# EAGLE schematic Blueberry Pi 7.1+axp203 (EAGLE 6.4)

## Sheet 1 of 5: IO / LRADC / RTL8237BS / Touch / SPI Flash
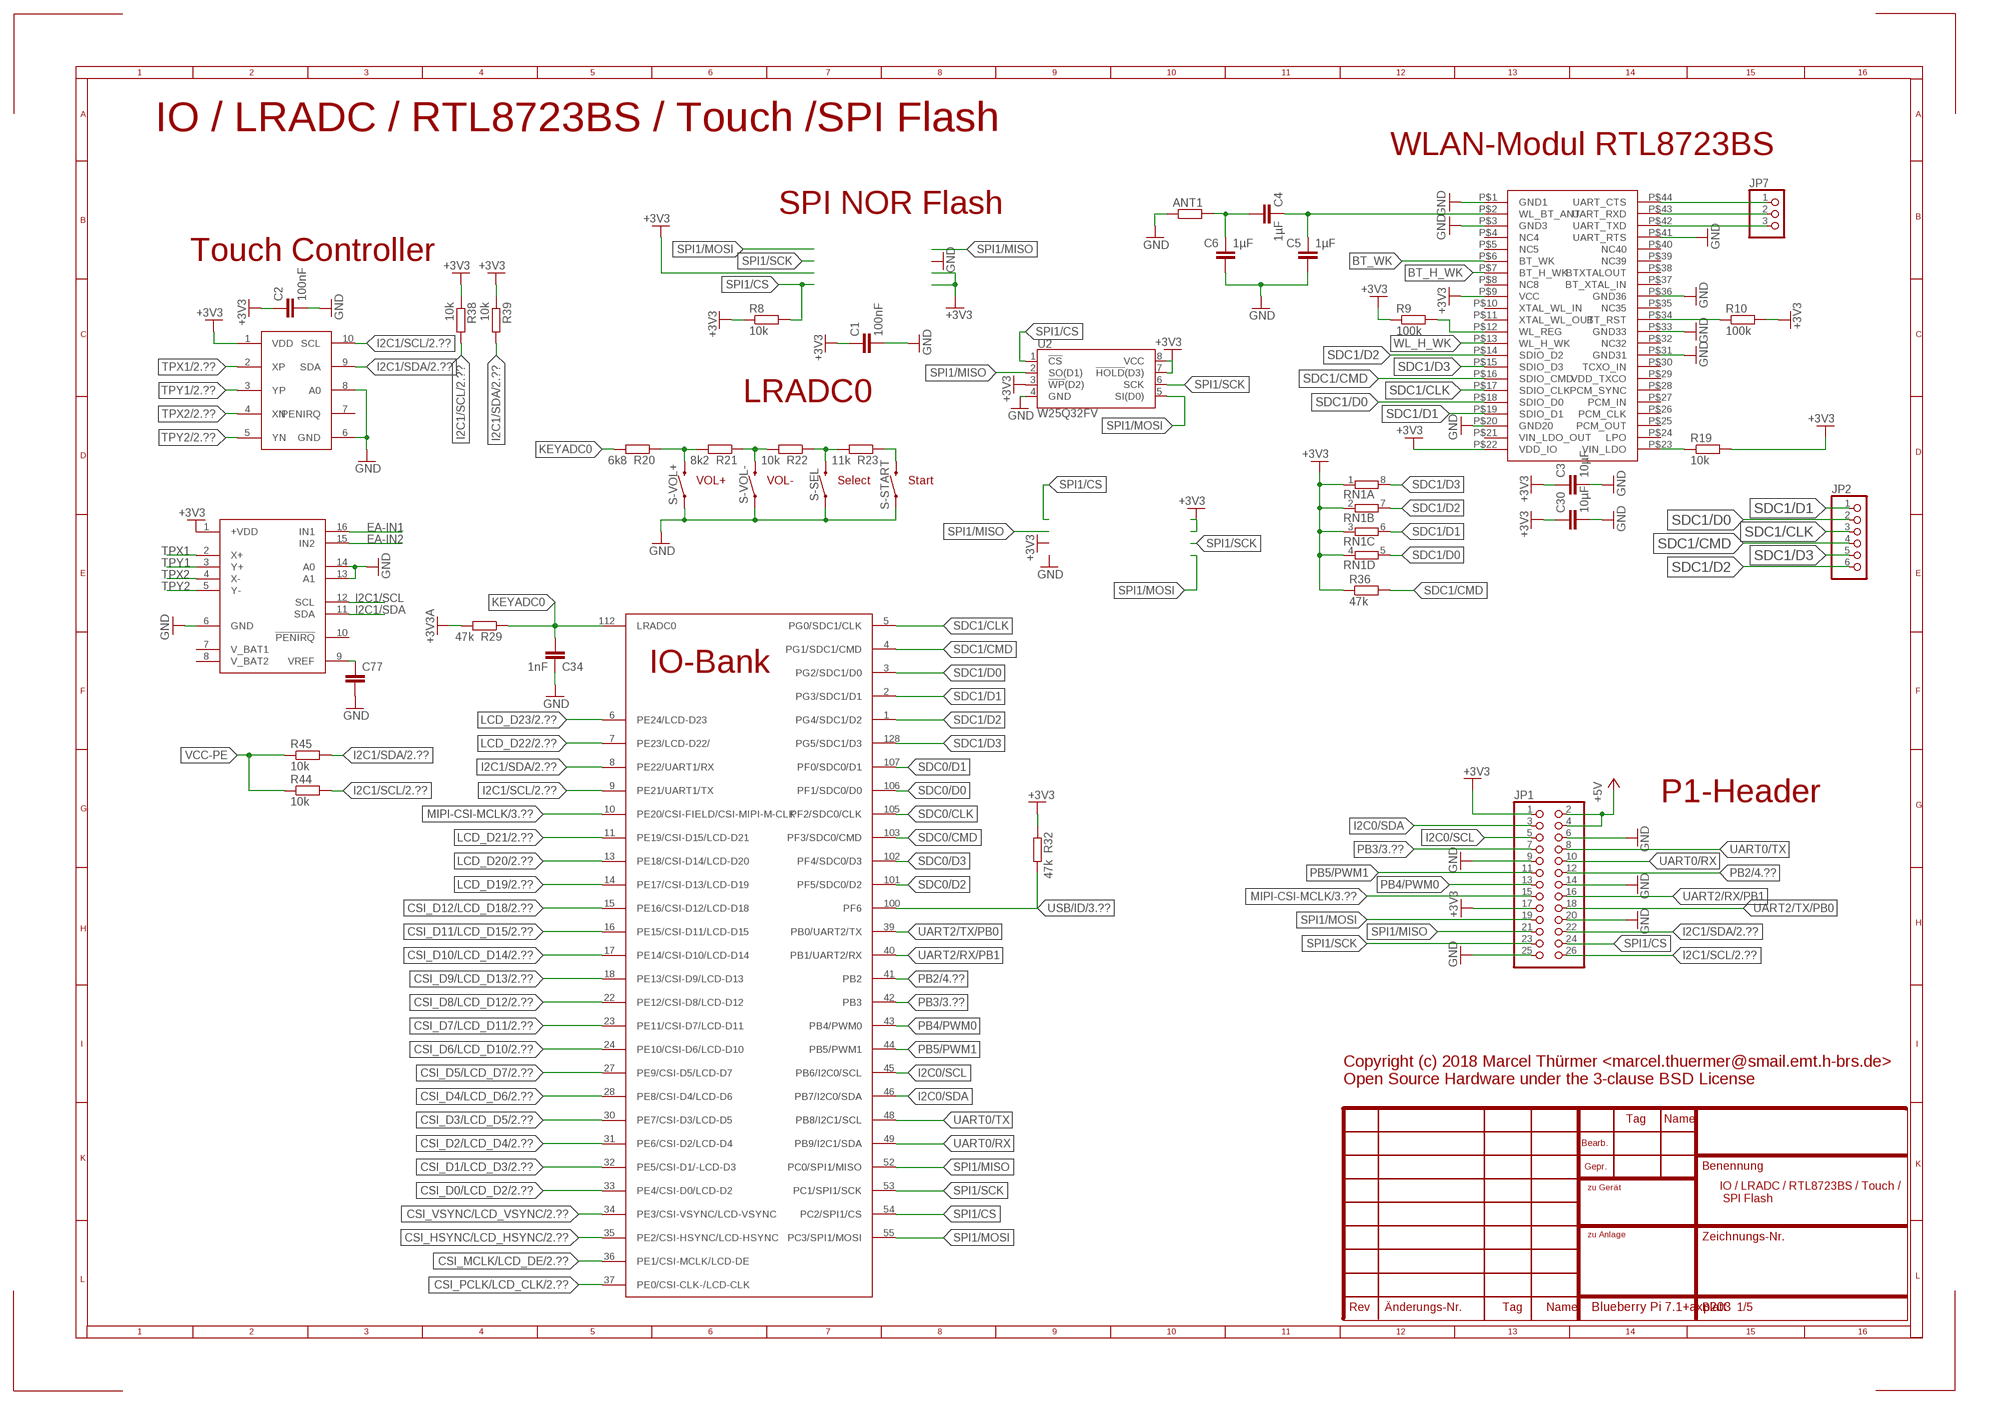
[diagram p0: schematic, sheet 1]

### Parts
ANT1  R-EU_R1206  [R1206]
C1  100nF  C-EUC0603  [C0603]
C2  100nF  C-EUC0603  [C0603]
C3  10µF  C-EUC0805  [C0805]
C4  1µF  C-EUC0603  [C0603]
C5  1µF  C-EUC0603  [C0603]
C6  1µF  C-EUC0603  [C0603]
C30  10µF  C-EUC0805  [C0805]
C34  1nF  C-EUC0603  [C0603]
C77  C-EUC0805  [C0805]
JP1  PINHD-2X13  [2X13]
JP2  PINHD-1X6_2.00  [1X06M]
JP7  PINHD-1X3M  [1X03M]
R8  10k  R-EU_R0603  [R0603]
R9  100k  R-EU_R0603  [R0603]
R10  100k  R-EU_R0603  [R0603]
R19  10k  R-EU_R0603  [R0603]
R20  6k8  R-EU_R0603  [R0603]
R21  8k2  R-EU_R0603  [R0603]
R22  10k  R-EU_R0603  [R0603]
R23  11k  R-EU_R0603  [R0603]
R29  47k  R-EU_R0603  [R0603]
R32  47k  R-EU_R0603  [R0603]
R36  47k  R-EU_R0603  [R0603]
R38  10k  R-EU_R0603  [R0603]
R39  10k  R-EU_R0603  [R0603]
R44  10k  R-EU_R0603  [R0603]
R45  10k  R-EU_R0603  [R0603]
RN1  4R-NEXB38V  [EXB38V]
S-SEL  SPARKFUN-SWITCHES_MOMENTARY-SWITCH-SPST-SMD-5.2-REDUNDANT  [SPARKFUN-SWITCHES_TACTILE_SWITCH_SMD_5.2MM]
S-START  SPARKFUN-SWITCHES_MOMENTARY-SWITCH-SPST-SMD-5.2-REDUNDANT  [SPARKFUN-SWITCHES_TACTILE_SWITCH_SMD_5.2MM]
S-VOL+  SPARKFUN-SWITCHES_MOMENTARY-SWITCH-SPST-SMD-5.2-REDUNDANT  [SPARKFUN-SWITCHES_TACTILE_SWITCH_SMD_5.2MM]
S-VOL-  SPARKFUN-SWITCHES_MOMENTARY-SWITCH-SPST-SMD-5.2-REDUNDANT  [SPARKFUN-SWITCHES_TACTILE_SWITCH_SMD_5.2MM]
U2  W25Q32FV  W25Q32FVSS  [SOIC-8]
U$1  V3S  [QFP-128]
U$2  RTL8723BS  [LGA]
U$7  TSC2003  [TSSOP16]
U$8  NS2009  [MSOP10]

### Nets
+3V3: C1.1 C2.1 C3.1 C30.1 JP1.1 JP1.17 R8.1 R9.1 R10.2 R19.2 R32.1 R36.1 R38.1 R39.1 RN1.1 RN1.2 RN1.3 RN1.4 U2.3(!WP!(D2)) U2.7(!HOLD!(D3)) U2.8(VCC) U$2.P$9(VCC) U$2.P$22(VDD_IO) U$7.1(+VDD) U$8.1(VDD) ; also sheet 2,3,4,5
+3V3A: R29.2 ; also sheet 3,4
+5V: JP1.2 JP1.4 ; also sheet 2,3,4
BT_H_WK: U$2.P$7(BT_H_WK)
BT_WK: U$2.P$6(BT_WK)
CSI_D0/LCD_D2: U$1.33(PE4/CSI-D0/LCD-D2) ; also sheet 2,5
CSI_D1/LCD_D3: U$1.32(PE5/CSI-D1/-LCD-D3) ; also sheet 2,5
CSI_D2/LCD_D4: U$1.31(PE6/CSI-D2/LCD-D4) ; also sheet 2,5
CSI_D3/LCD_D5: U$1.30(PE7/CSI-D3/LCD-D5) ; also sheet 2,5
CSI_D4/LCD_D6: U$1.28(PE8/CSI-D4/LCD-D6) ; also sheet 2,5
CSI_D5/LCD_D7: U$1.27(PE9/CSI-D5/LCD-D7) ; also sheet 2,5
CSI_D6/LCD_D10: U$1.24(PE10/CSI-D6/LCD-D10) ; also sheet 2,5
CSI_D7/LCD_D11: U$1.23(PE11/CSI-D7/LCD-D11) ; also sheet 2,5
CSI_D8/LCD_D12: U$1.22(PE12/CSI-D8/LCD-D12) ; also sheet 2,5
CSI_D9/LCD_D13: U$1.18(PE13/CSI-D9/LCD-D13) ; also sheet 2,5
CSI_D10/LCD_D14: U$1.17(PE14/CSI-D10/LCD-D14) ; also sheet 2,5
CSI_D11/LCD_D15: U$1.16(PE15/CSI-D11/LCD-D15) ; also sheet 2,5
CSI_D12/LCD_D18: U$1.15(PE16/CSI-D12/LCD-D18) ; also sheet 2,5
CSI_HSYNC/LCD_HSYNC: U$1.35(PE2/CSI-HSYNC/LCD-HSYNC) ; also sheet 2,5
CSI_MCLK/LCD_DE: U$1.36(PE1/CSI-MCLK/LCD-DE) ; also sheet 2,5
CSI_PCLK/LCD_CLK: U$1.37(PE0/CSI-CLK-/LCD-CLK) ; also sheet 2,5
CSI_VSYNC/LCD_VSYNC: U$1.34(PE3/CSI-VSYNC/LCD-VSYNC) ; also sheet 2,5
EA-IN1: U$7.16(IN1) ; also sheet 2
EA-IN2: U$7.15(IN2) ; also sheet 2
GND: ANT1.1 C1.2 C2.2 C3.2 C5.2 C6.2 C30.2 C34.1 C77.2 JP1.6 JP1.9 JP1.14 JP1.20 JP1.25 S-SEL.1 S-SEL.2 S-START.1 S-START.2 S-VOL+.1 S-VOL+.2 S-VOL-.1 S-VOL-.2 U2.4(GND) U$2.P$1(GND1) U$2.P$3(GND3) U$2.P$20(GND20) U$2.P$31(GND31) U$2.P$33(GND33) U$2.P$36(GND36) U$2.P$41(UART_RTS) U$7.6(GND) U$7.13(A1) U$7.14(A0) U$8.6(GND) U$8.8(A0) ; also sheet 2,3,4,5
I2C0/SCL: JP1.5 U$1.45(PB6/I2C0/SCL)
I2C0/SDA: JP1.3 U$1.46(PB7/I2C0/SDA)
I2C1/SCL: JP1.26 R38.2 R44.2 U$1.9(PE21/UART1/TX) U$7.12(SCL) U$8.10(SCL) ; also sheet 2,3,4
I2C1/SDA: JP1.22 R39.2 R45.2 U$1.8(PE22/UART1/RX) U$7.11(SDA) U$8.9(SDA) ; also sheet 2,3,4
KEYADC0: C34.2 R20.2 R29.1 U$1.112(LRADC0)
LCD_D19: U$1.14(PE17/CSI-D13/LCD-D19) ; also sheet 2,5
LCD_D20: U$1.13(PE18/CSI-D14/LCD-D20) ; also sheet 2,5
LCD_D21: U$1.11(PE19/CSI-D15/LCD-D21) ; also sheet 2,5
LCD_D22: U$1.7(PE23/LCD-D22/) ; also sheet 2,5
LCD_D23: U$1.6(PE24/LCD-D23) ; also sheet 2,5
MIPI-CSI-MCLK: JP1.15 U$1.10(PE20/CSI-FIELD/CSI-MIPI-M-CLK) ; also sheet 3
N$4: R19.1 U$2.P$23(VIN_LDO)
N$7: R9.2 U$2.P$12(WL_REG)
N$8: R20.1 R21.2 S-VOL+.3 S-VOL+.4
N$11: C77.1 U$7.9(VREF)
N$12: R10.1 U$2.P$34(BT_RST)
N$13: C4.1 C5.1 U$2.P$2(WL_BT_ANT)
N$14: ANT1.2 C4.2 C6.1
N$41: R21.1 R22.2 S-VOL-.3 S-VOL-.4
N$42: R22.1 R23.2 S-SEL.3 S-SEL.4
N$43: R23.1 S-START.3 S-START.4
N$61: JP7.1 U$2.P$44(UART_CTS)
N$62: JP7.2 U$2.P$43(UART_RXD)
N$63: JP7.3 U$2.P$42(UART_TXD)
PB2: JP1.12 U$1.41(PB2) ; also sheet 4
PB3: JP1.7 U$1.42(PB3) ; also sheet 3
PB4/PWM0: JP1.13 U$1.43(PB4/PWM0)
PB5/PWM1: JP1.11 U$1.44(PB5/PWM1)
SDC0/CLK: U$1.105(PF2/SDC0/CLK) ; also sheet 3
SDC0/CMD: U$1.103(PF3/SDC0/CMD) ; also sheet 3
SDC0/D0: U$1.106(PF1/SDC0/D0) ; also sheet 3
SDC0/D1: U$1.107(PF0/SDC0/D1) ; also sheet 3
SDC0/D2: U$1.101(PF5/SDC0/D2) ; also sheet 3
SDC0/D3: U$1.102(PF4/SDC0/D3) ; also sheet 3
SDC1/CLK: JP2.3 U$1.5(PG0/SDC1/CLK) U$2.P$17(SDIO_CLK)
SDC1/CMD: JP2.4 R36.2 U$1.4(PG1/SDC1/CMD) U$2.P$16(SDIO_CMD)
SDC1/D0: JP2.2 RN1.5 U$1.3(PG2/SDC1/D0) U$2.P$18(SDIO_D0)
SDC1/D1: JP2.1 RN1.6 U$1.2(PG3/SDC1/D1) U$2.P$19(SDIO_D1)
SDC1/D2: JP2.6 RN1.7 U$1.1(PG4/SDC1/D2) U$2.P$14(SDIO_D2)
SDC1/D3: JP2.5 RN1.8 U$1.128(PG5/SDC1/D3) U$2.P$15(SDIO_D3)
SPI1/CS: JP1.24 R8.2 U2.1(!CS!) U$1.54(PC2/SPI1/CS)
SPI1/MISO: JP1.21 U2.2(SO(D1)) U$1.52(PC0/SPI1/MISO)
SPI1/MOSI: JP1.19 U2.5(SI(D0)) U$1.55(PC3/SPI1/MOSI)
SPI1/SCK: JP1.23 U2.6(SCK) U$1.53(PC1/SPI1/SCK)
TPX1: U$7.2(X+) U$8.2(XP) ; also sheet 2
TPX2: U$7.4(X-) U$8.4(XN) ; also sheet 2
TPY1: U$7.3(Y+) U$8.3(YP) ; also sheet 2
TPY2: U$7.5(Y-) U$8.5(YN) ; also sheet 2
UART0/RX: JP1.10 U$1.49(PB9/I2C1/SDA)
UART0/TX: JP1.8 U$1.48(PB8/I2C1/SCL)
UART2/RX/PB1: JP1.16 U$1.40(PB1/UART2/RX)
UART2/TX/PB0: JP1.18 U$1.39(PB0/UART2/TX)
USB/ID: R32.2 U$1.100(PF6) ; also sheet 3
VCC-PE: R44.1 R45.1 ; also sheet 4
WL_H_WK: U$2.P$13(WL_H_WK)
Unconnected: U$2.P$4(NC4) U$2.P$5(NC5) U$2.P$8(NC8) U$2.P$10(XTAL_WL_IN) U$2.P$11(XTAL_WL_OUT) U$2.P$21(VIN_LDO_OUT) U$2.P$24(LPO) U$2.P$25(PCM_OUT) U$2.P$26(PCM_CLK) U$2.P$27(PCM_IN) U$2.P$28(PCM_SYNC) U$2.P$29(VDD_TXCO) U$2.P$30(TCXO_IN) U$2.P$32(NC32) U$2.P$35(NC35) U$2.P$37(BT_XTAL_IN) U$2.P$38(BTXTALOUT) U$2.P$39(NC39) U$2.P$40(NC40) U$7.7(V_BAT1) U$7.8(V_BAT2) U$7.10(!PENIRQ) U$8.7(PENIRQ)

### Notes on the sheet
- IO / LRADC / RTL8723BS / Touch /SPI Flash
- WLAN-Modul RTL8723BS
- SPI NOR Flash
- Touch Controller
- LRADC0
- VOL+ | VOL- | Select | Start
- P1-Header
- Copyright (c) 2018 Marcel Thürmer <marcel.thuermer@smail.emt.h-brs.de>
  Open Source Hardware under the 3-clause BSD License
- IO / LRADC / RTL8723BS / Touch /
   SPI Flash

## Sheet 2 of 5: LCD FFC / Camera FFC / Camera Header (OV7670, OV2640)
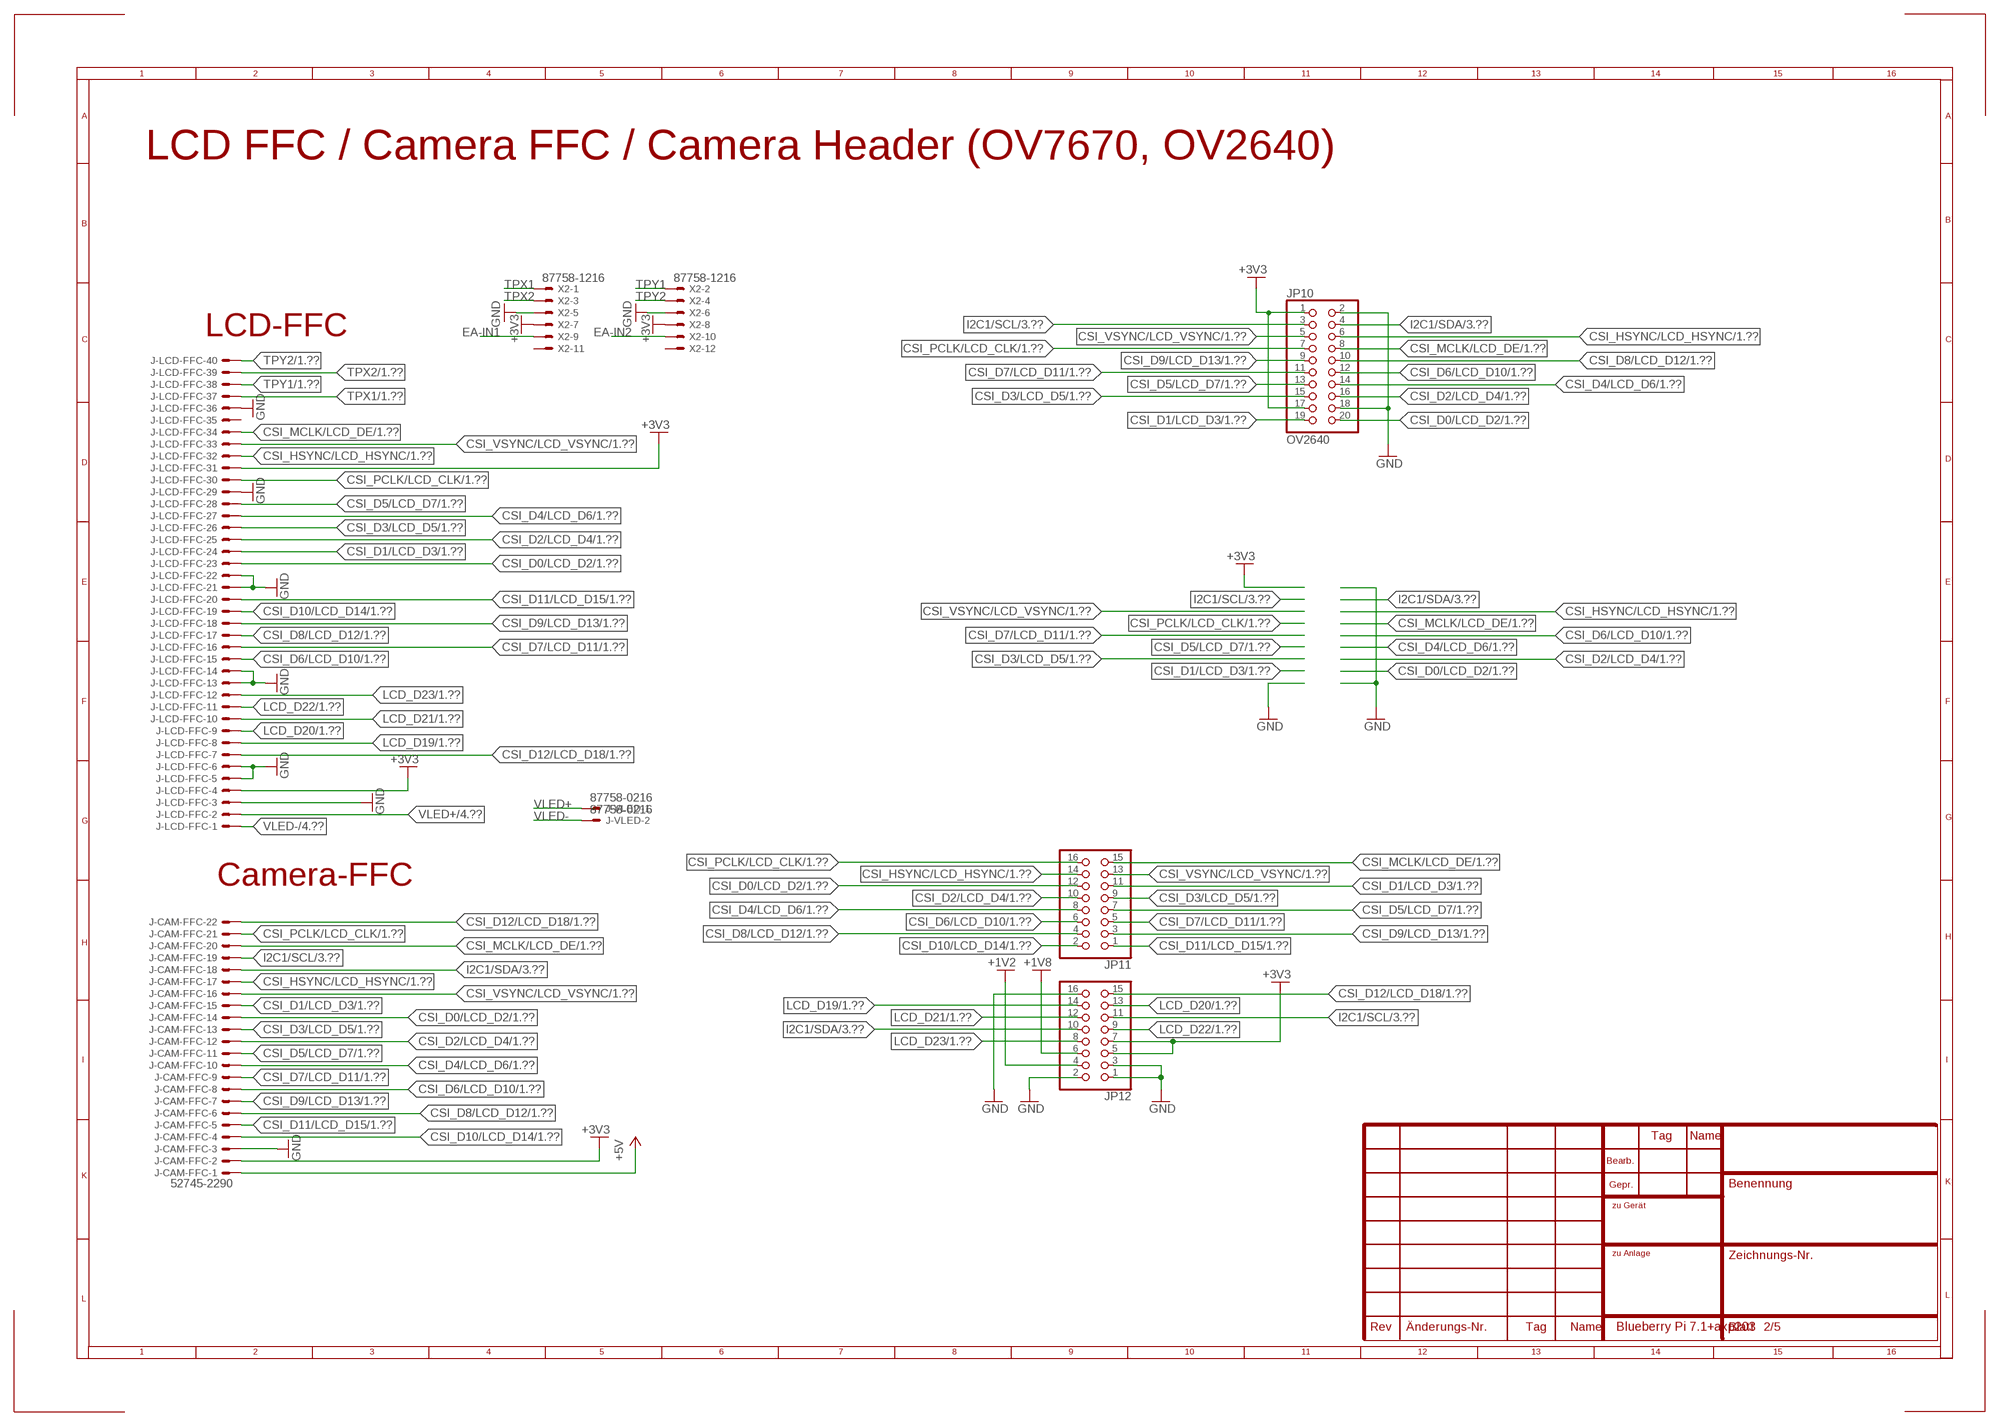
[diagram p1: schematic, sheet 2]

### Parts
J-CAM-FFC  52745-2290  [52745-2290]
J-LCD-FFC  40PINFPCH15-1LW  [XF2H-4015-1LW]
J-VLED  87758-0216  [87758-0216]
JP10  OV2640  PINHD-2X10  [2X10]
JP11  PINHD-2X8M  [2X08M]
JP12  PINHD-2X8M  [2X08M]
X2  87758-1216  [87758-1216]

### Nets
+1V2: JP12.4 ; also sheet 4
+1V8: JP12.6 ; also sheet 4
+3V3: J-CAM-FFC.2 J-LCD-FFC.4 J-LCD-FFC.31 JP10.1 JP10.17 JP12.5 JP12.7 X2.7 X2.8 ; also sheet 1,3,4,5
+5V: J-CAM-FFC.1 ; also sheet 1,3,4
CSI_D0/LCD_D2: J-CAM-FFC.14 J-LCD-FFC.23 JP10.20 JP11.12 ; also sheet 1,5
CSI_D1/LCD_D3: J-CAM-FFC.15 J-LCD-FFC.24 JP10.19 JP11.11 ; also sheet 1,5
CSI_D2/LCD_D4: J-CAM-FFC.12 J-LCD-FFC.25 JP10.16 JP11.10 ; also sheet 1,5
CSI_D3/LCD_D5: J-CAM-FFC.13 J-LCD-FFC.26 JP10.15 JP11.9 ; also sheet 1,5
CSI_D4/LCD_D6: J-CAM-FFC.10 J-LCD-FFC.27 JP10.14 JP11.8 ; also sheet 1,5
CSI_D5/LCD_D7: J-CAM-FFC.11 J-LCD-FFC.28 JP10.13 JP11.7 ; also sheet 1,5
CSI_D6/LCD_D10: J-CAM-FFC.8 J-LCD-FFC.15 JP10.12 JP11.6 ; also sheet 1,5
CSI_D7/LCD_D11: J-CAM-FFC.9 J-LCD-FFC.16 JP10.11 JP11.5 ; also sheet 1,5
CSI_D8/LCD_D12: J-CAM-FFC.6 J-LCD-FFC.17 JP10.10 JP11.4 ; also sheet 1,5
CSI_D9/LCD_D13: J-CAM-FFC.7 J-LCD-FFC.18 JP10.9 JP11.3 ; also sheet 1,5
CSI_D10/LCD_D14: J-CAM-FFC.4 J-LCD-FFC.19 JP11.2 ; also sheet 1,5
CSI_D11/LCD_D15: J-CAM-FFC.5 J-LCD-FFC.20 JP11.1 ; also sheet 1,5
CSI_D12/LCD_D18: J-CAM-FFC.22 J-LCD-FFC.7 JP12.15 ; also sheet 1,5
CSI_HSYNC/LCD_HSYNC: J-CAM-FFC.17 J-LCD-FFC.32 JP10.6 JP11.14 ; also sheet 1,5
CSI_MCLK/LCD_DE: J-CAM-FFC.20 J-LCD-FFC.34 JP10.8 JP11.15 ; also sheet 1,5
CSI_PCLK/LCD_CLK: J-CAM-FFC.21 J-LCD-FFC.30 JP10.7 JP11.16 ; also sheet 1,5
CSI_VSYNC/LCD_VSYNC: J-CAM-FFC.16 J-LCD-FFC.33 JP10.5 JP11.13 ; also sheet 1,5
EA-IN1: X2.9 ; also sheet 1
EA-IN2: X2.10 ; also sheet 1
GND: J-CAM-FFC.3 J-LCD-FFC.3 J-LCD-FFC.5 J-LCD-FFC.6 J-LCD-FFC.13 J-LCD-FFC.14 J-LCD-FFC.21 J-LCD-FFC.22 J-LCD-FFC.29 J-LCD-FFC.36 JP10.2 JP10.18 JP12.1 JP12.2 JP12.3 JP12.16 X2.5 X2.6 ; also sheet 1,3,4,5
I2C1/SCL: J-CAM-FFC.19 JP10.3 JP12.11 ; also sheet 1,3,4
I2C1/SDA: J-CAM-FFC.18 JP10.4 JP12.10 ; also sheet 1,3,4
LCD_D19: J-LCD-FFC.8 JP12.14 ; also sheet 1,5
LCD_D20: J-LCD-FFC.9 JP12.13 ; also sheet 1,5
LCD_D21: J-LCD-FFC.10 JP12.12 ; also sheet 1,5
LCD_D22: J-LCD-FFC.11 JP12.9 ; also sheet 1,5
LCD_D23: J-LCD-FFC.12 JP12.8 ; also sheet 1,5
TPX1: J-LCD-FFC.37 X2.1 ; also sheet 1
TPX2: J-LCD-FFC.39 X2.3 ; also sheet 1
TPY1: J-LCD-FFC.38 X2.2 ; also sheet 1
TPY2: J-LCD-FFC.40 X2.4 ; also sheet 1
VLED+: J-LCD-FFC.2 J-VLED.1 ; also sheet 4
VLED-: J-LCD-FFC.1 J-VLED.2 ; also sheet 4
Unconnected: J-LCD-FFC.35 X2.11 X2.12

### Notes on the sheet
- LCD FFC / Camera FFC / Camera Header (OV7670, OV2640)
- LCD-FFC
- Camera-FFC

## Sheet 3 of 5: Ethernet / USB Host / SDC0 / Audio / MIPI CSI
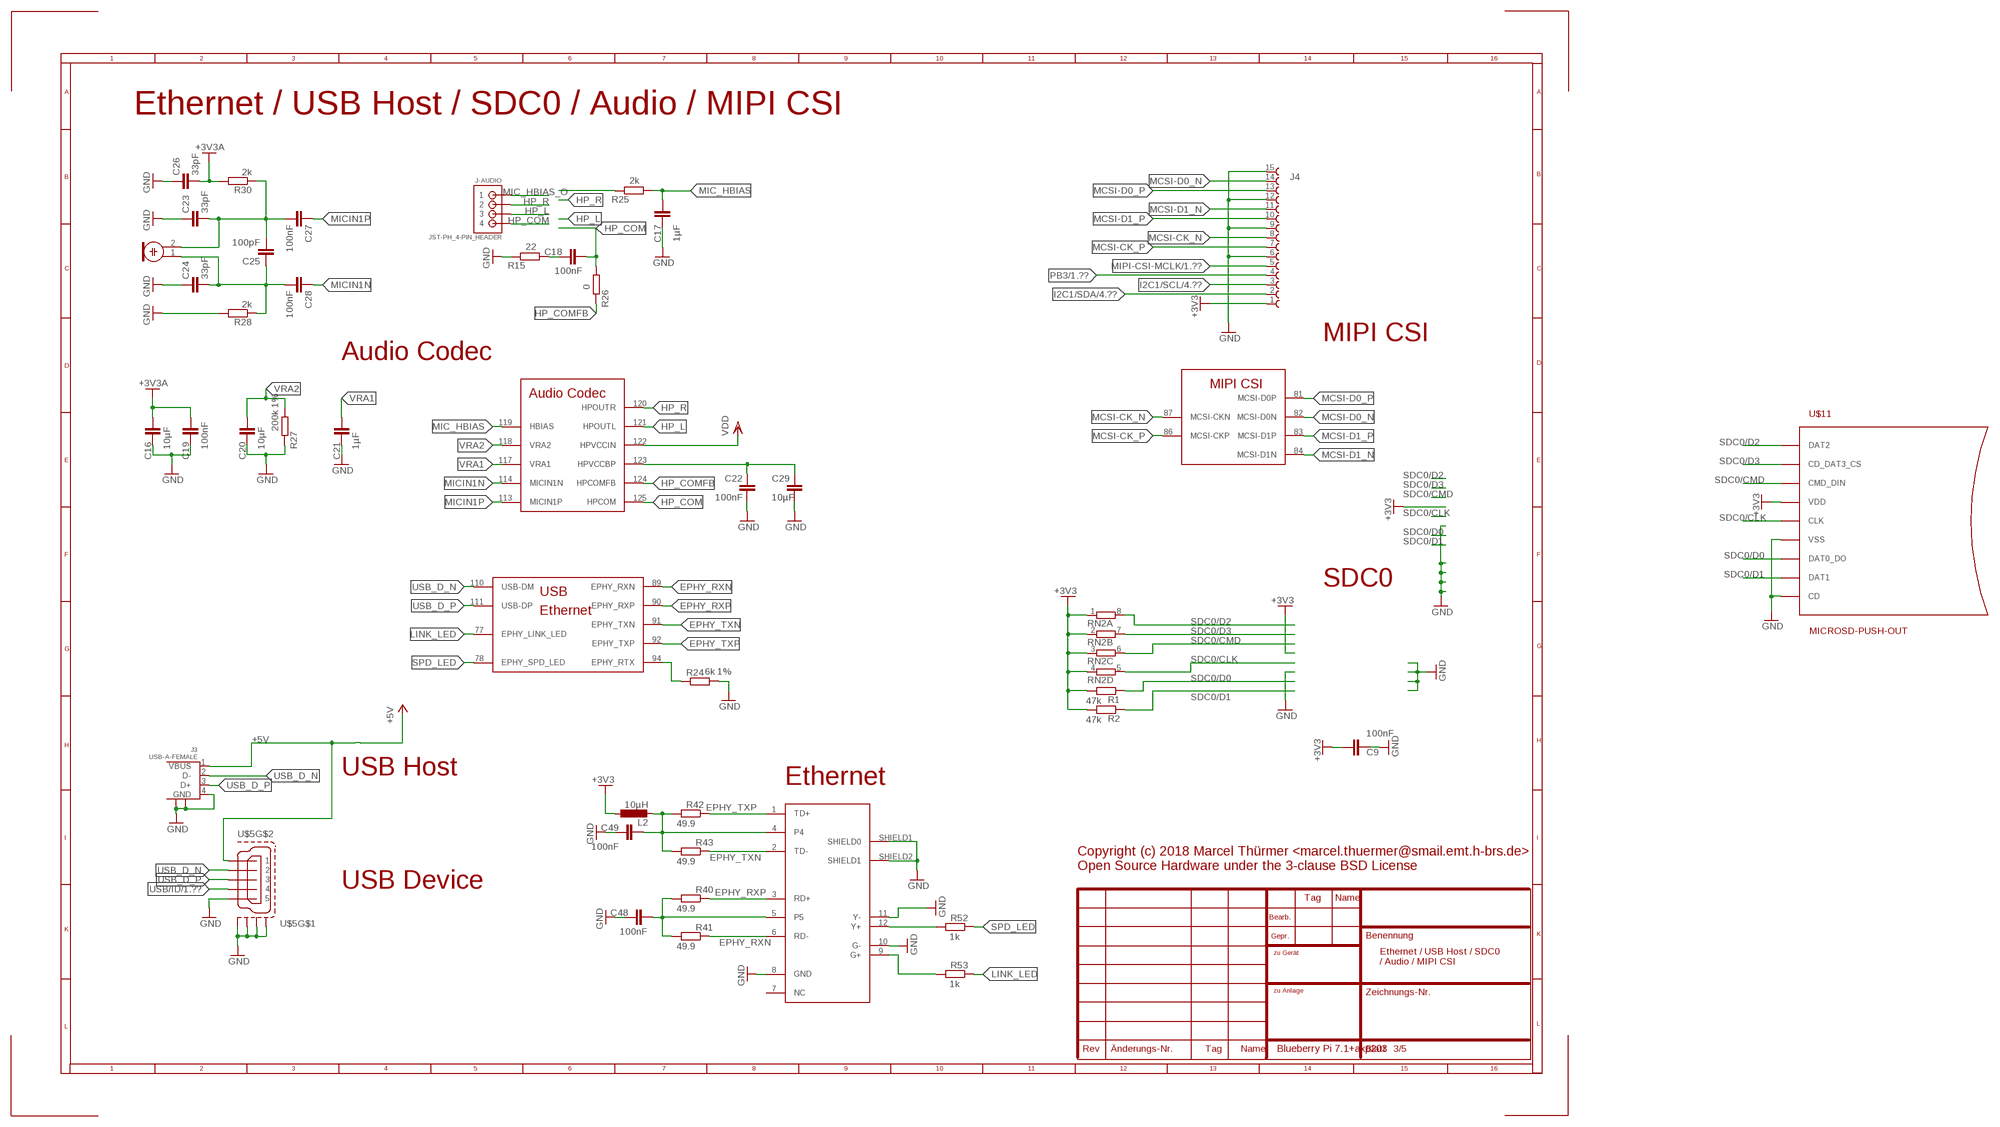
[diagram p2: schematic, sheet 3]

### Parts
C9  100nF  C-EUC0603  [C0603]
C16  10µF  C-EUC0805  [C0805]
C17  1µF  C-EUC0603  [C0603]
C18  100nF  C-EUC0603  [C0603]
C19  100nF  C-EUC0603  [C0603]
C20  10µF  C-EUC0805  [C0805]
C21  1µF  C-EUC0603  [C0603]
C22  100nF  C-EUC0603  [C0603]
C23  33pF  C-EUC0603  [C0603]
C24  33pF  C-EUC0603  [C0603]
C25  100pF  C-EUC0603  [C0603]
C26  33pF  C-EUC0603  [C0603]
C27  100nF  C-EUC0603  [C0603]
C28  100nF  C-EUC0603  [C0603]
C29  10µF  C-EUC0805  [C0805]
C48  100nF  C-EUC0603  [C0603]
C49  100nF  C-EUC0603  [C0603]
J3  USB-A-FEMALE  [USB-A-FEMALE]
J4  68611514122  [68611514122]
J-AUDIO  JST-PH_4-PIN_HEADER  [JST_B4B-PH_HEADER]
L2  10µH  L-EUR0805  [R0805]
MIC  ELECTRET_MICROPHON-F6035AP  [F6035AP]
R1  47k  R-EU_R0603  [R0603]
R2  47k  R-EU_R0603  [R0603]
R15  22  R-EU_R0603  [R0603]
R24  6k 1%  R-EU_R0603  [R0603]
R25  2k  R-EU_R0603  [R0603]
R26  0  R-EU_R0603  [R0603]
R27  200k 1%  R-EU_R0603  [R0603]
R28  2k  R-EU_R0603  [R0603]
R30  2k  R-EU_R0603  [R0603]
R40  49.9  R-EU_R0603  [R0603]
R41  49.9  R-EU_R0603  [R0603]
R42  49.9  R-EU_R0603  [R0603]
R43  49.9  R-EU_R0603  [R0603]
R52  1k  R-EU_R0603  [R0603]
R53  1k  R-EU_R0603  [R0603]
RN2  4R-NEXB38V  [EXB38V]
U$3  HR911105A  [RJ45]
U$5  MICRO-USB-SHIELD-ZX62R-B-5P  [ZX62R-B-5P]
U$11  MICROSD-PUSH-OUT  [MICROSD-PUSH-OUT]

### Nets
+3V3: C9.1 J4.1 L2.1 R1.2 R2.2 RN2.1 RN2.2 RN2.3 RN2.4 U$11.4(VDD) ; also sheet 1,2,4,5
+3V3A: C16.2 C19.2 C26.2 R30.2 ; also sheet 1,4
+5V: J3.1(VBUS) U$5.1 ; also sheet 1,2,4
EPHY_RXN: R41.1 U$1.89(EPHY_RXN) U$3.6(RD-)
EPHY_RXP: R40.1 U$1.90(EPHY_RXP) U$3.3(RD+)
EPHY_TXN: R43.1 U$1.91(EPHY_TXN) U$3.2(TD-)
EPHY_TXP: R42.1 U$1.92(EPHY_TXP) U$3.1(TD+)
GND: C9.2 C16.1 C17.2 C19.1 C20.1 C21.1 C22.2 C23.1 C24.1 C26.1 C29.1 C48.2 C49.2 J3.4(GND) J3.P$1 J3.P$2 J4.6 J4.9 J4.12 J4.15 R15.1 R24.2 R27.1 R28.2 U$3.8(GND) U$3.10(G-) U$3.11(Y-) U$3.SHIELD1(SHIELD0) U$3.SHIELD2(SHIELD1) U$5.5 U$5.M1(S1) U$5.M2(S2) U$5.M3(S3) U$5.M4(S4) U$11.6(VSS) U$11.CD U$11.G1(VSS) U$11.G2(VSS) U$11.G3(VSS) U$11.G4(VSS) ; also sheet 1,2,4,5
HP_COM: C18.2 J-AUDIO.P4 R26.2 U$1.125(HPCOM)
HP_COMFB: R26.1 U$1.124(HPCOMFB)
HP_L: J-AUDIO.P3 U$1.121(HPOUTL)
HP_R: J-AUDIO.P2 U$1.120(HPOUTR)
I2C1/SCL: J4.3 ; also sheet 1,2,4
I2C1/SDA: J4.2 ; also sheet 1,2,4
LINK_LED: R53.1 U$1.77(EPHY_LINK_LED)
MCSI-CK_N: J4.8 U$1.87(MCSI-CKN)
MCSI-CK_P: J4.7 U$1.86(MCSI-CKP)
MCSI-D0_N: J4.14 U$1.82(MCSI-D0N)
MCSI-D0_P: J4.13 U$1.81(MCSI-D0P)
MCSI-D1_N: J4.11 U$1.84(MCSI-D1N)
MCSI-D1_P: J4.10 U$1.83(MCSI-D1P)
MIC_HBIAS: C17.1 R25.2 U$1.119(HBIAS)
MIC_HBIAS_O: J-AUDIO.P1 R25.1
MICIN1N: C28.1 U$1.114(MICIN1N)
MICIN1P: C27.1 U$1.113(MICIN1P)
MIPI-CSI-MCLK: J4.5 ; also sheet 1
N$1: R24.1 U$1.94(EPHY_RTX)
N$18: R53.2 U$3.9(G+)
N$20: R52.2 U$3.12(Y+)
N$21: C49.1 L2.2 R42.2 R43.2 U$3.4
N$22: C48.1 R40.2 R41.2 U$3.5
N$28: C22.1 C29.2 U$1.123(HPVCCBP)
N$47: C18.1 R15.2
N$48: C23.2 C25.2 C27.2 MIC.2 R30.1
N$49: C24.2 C25.1 C28.2 MIC.1 R28.1
PB3: J4.4 ; also sheet 1
SDC0/CLK: RN2.5 U$11.5(CLK) ; also sheet 1
SDC0/CMD: RN2.6 U$11.3(CMD_DIN) ; also sheet 1
SDC0/D0: R1.1 U$11.7(DAT0_DO) ; also sheet 1
SDC0/D1: R2.1 U$11.8(DAT1) ; also sheet 1
SDC0/D2: RN2.8 U$11.1(DAT2) ; also sheet 1
SDC0/D3: RN2.7 U$11.2(CD_DAT3_CS) ; also sheet 1
SPD_LED: R52.1 U$1.78(EPHY_SPD_LED)
USB/ID: U$5.4 ; also sheet 1
USB_D_N: J3.2(D-) U$1.110(USB-DM) U$5.2
USB_D_P: J3.3(D+) U$1.111(USB-DP) U$5.3
VDD: U$1.122(HPVCCIN) ; also sheet 4
VRA1: C21.2 U$1.117(VRA1)
VRA2: C20.2 R27.2 U$1.118(VRA2)
Unconnected: U$3.7(NC)

### Notes on the sheet
- Ethernet / USB Host / SDC0 / Audio / MIPI CSI
- MIPI CSI
- Audio Codec
- SDC0
- USB Host
- Ethernet
- Copyright (c) 2018 Marcel Thürmer <marcel.thuermer@smail.emt.h-brs.de>
  Open Source Hardware under the 3-clause BSD License
- USB Device
- Ethernet / USB Host / SDC0 
  / Audio / MIPI CSI

## Sheet 4 of 5: VCC / RTC / PLL
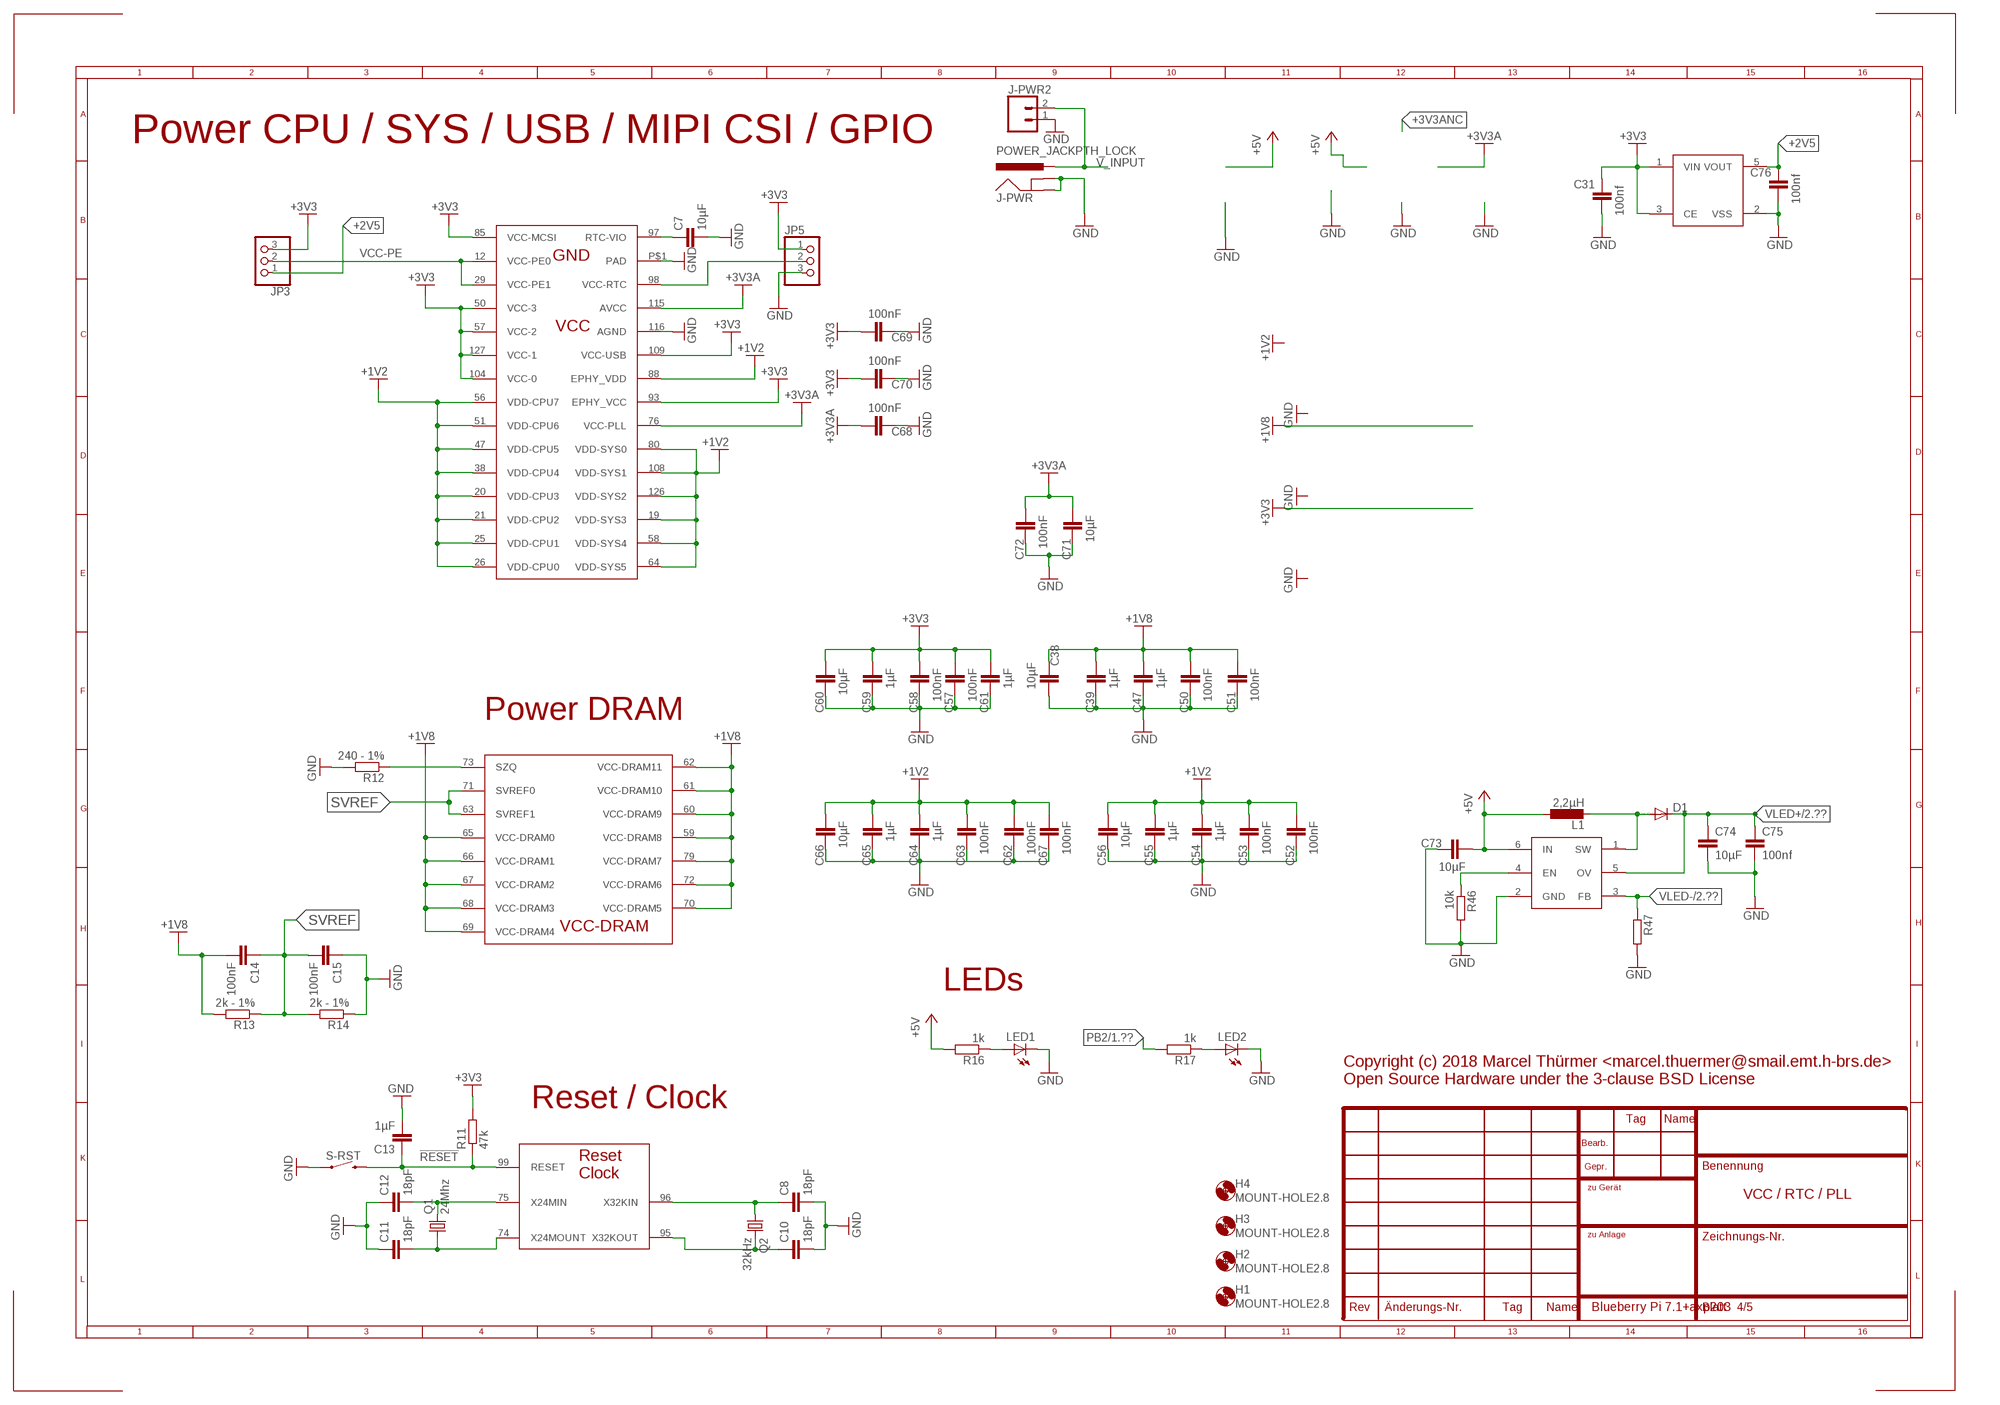
[diagram p3: schematic, sheet 4, part 1 of 2]
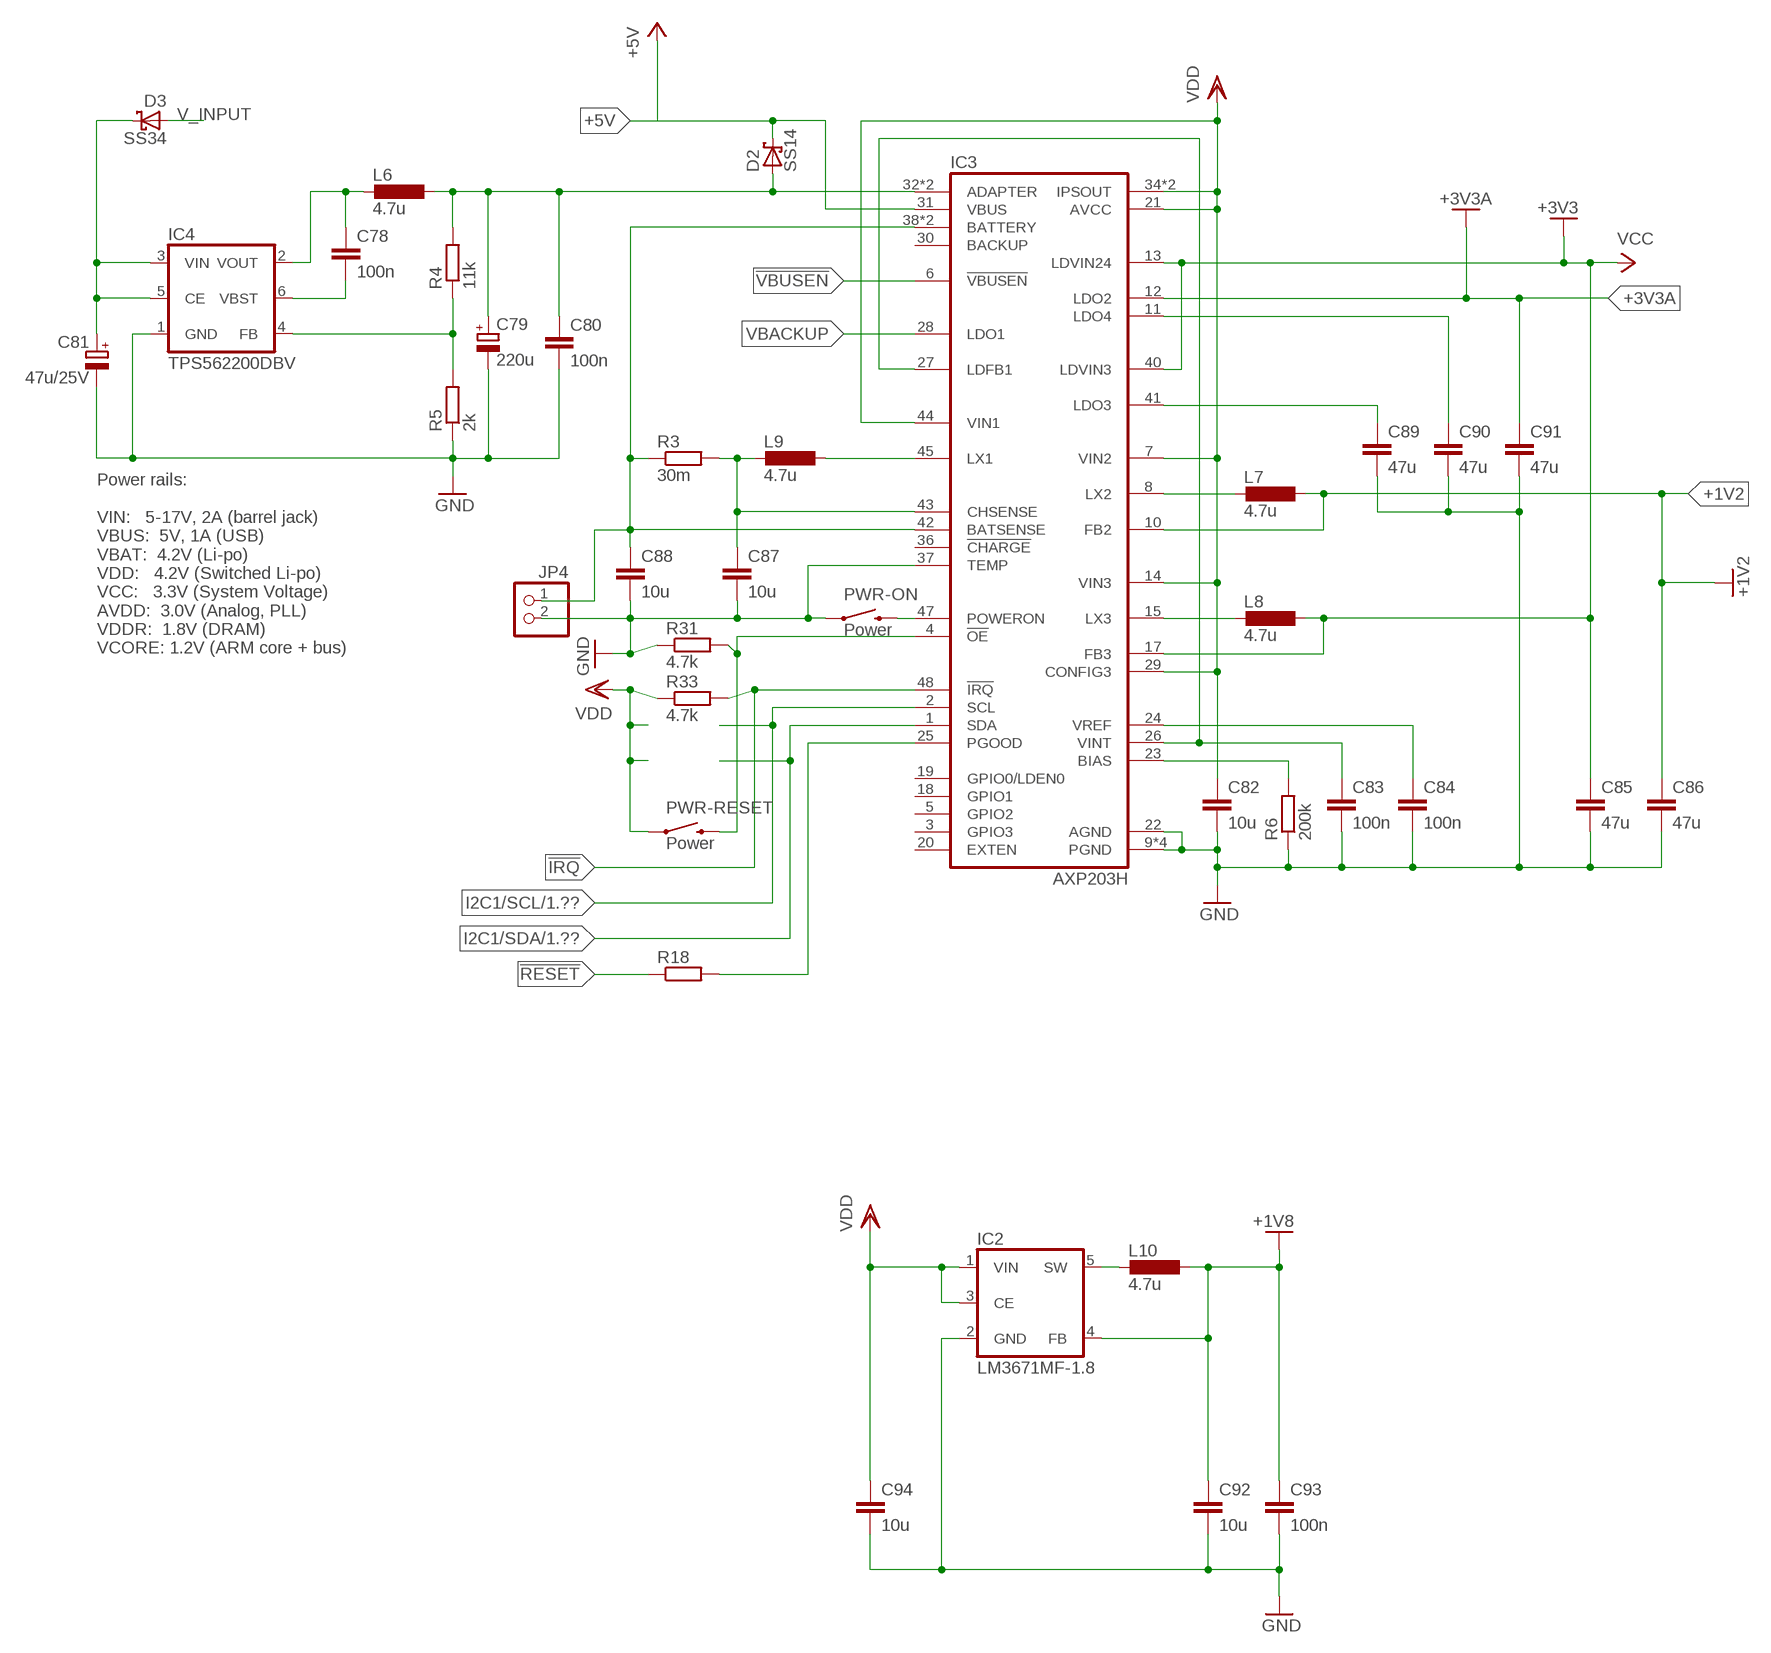
[diagram p4: schematic, sheet 4, part 2 of 2]

### Parts
C7  10µF  C-EUC0805  [C0805]
C8  18pF  C-EUC0603  [C0603]
C10  18pF  C-EUC0603  [C0603]
C11  18pF  C-EUC0603  [C0603]
C12  18pF  C-EUC0603  [C0603]
C13  1µF  C-EUC0603  [C0603]
C14  100nF  C-EUC0603  [C0603]
C15  100nF  C-EUC0603  [C0603]
C31  100nf  C-EUC0603  [C0603]
C38  10µF  C-EUC0603  [C0603]
C39  1µF  C-EUC0603  [C0603]
C47  1µF  C-EUC0603  [C0603]
C50  100nF  C-EUC0805  [C0805]
C51  100nF  C-EUC0603  [C0603]
C52  100nF  C-EUC0805  [C0805]
C53  100nF  C-EUC0603  [C0603]
C54  1µF  C-EUC0805  [C0805]
C55  1µF  C-EUC0603  [C0603]
C56  10µF  C-EUC0603  [C0603]
C57  100nF  C-EUC0603  [C0603]
C58  100nF  C-EUC0603  [C0603]
C59  1µF  C-EUC0805  [C0805]
C60  10µF  C-EUC0603  [C0603]
C61  1µF  C-EUC0805  [C0805]
C62  100nF  C-EUC0603  [C0603]
C63  100nF  C-EUC0805  [C0805]
C64  1µF  C-EUC0603  [C0603]
C65  1µF  C-EUC0603  [C0603]
C66  10µF  C-EUC0805  [C0805]
C67  100nF  C-EUC0603  [C0603]
C68  100nF  C-EUC0603  [C0603]
C69  100nF  C-EUC0805  [C0805]
C70  100nF  C-EUC0603  [C0603]
C71  10µF  C-EUC0603  [C0603]
C72  100nF  C-EUC0603  [C0603]
C73  10µF  C-EUC0805  [C0805]
C74  10µF  C-EUC0805  [C0805]
C75  100nf  C-EUC0603  [C0603]
C76  100nf  C-EUC0603  [C0603]
C78  100n  C-EUC0603  [C0603]
C79  220u  CPOL-EU153CLV-0405  [153CLV-0405]
C80  100n  C-EUC0603  [C0603]
C81  47u/25V  CPOL-EU153CLV-0405  [153CLV-0405]
C82  10u  C-EUC0805  [C0805]
C83  100n  C-EUC0603  [C0603]
C84  100n  C-EUC0603  [C0603]
C85  47u  C-EUC1206  [C1206]
C86  47u  C-EUC1206  [C1206]
C87  10u  C-EUC0805  [C0805]
C88  10u  C-EUC0805  [C0805]
C89  47u  C-EUC1206  [C1206]
C90  47u  C-EUC1206  [C1206]
C91  47u  C-EUC1206  [C1206]
C92  10u  C-EUC0805  [C0805]
C93  100n  C-EUC0603  [C0603]
C94  10u  C-EUC0805  [C0805]
D1  DIODE-SOD323-W  [SOD323-W]
D2  SS14  SCHOTTKY-DIODEDO214AC  [DO214AC]
D3  SS34  SCHOTTKY-DIODEDO214AC  [DO214AC]
H1  MOUNT-HOLE2.8  [2,8]
H2  MOUNT-HOLE2.8  [2,8]
H3  MOUNT-HOLE2.8  [2,8]
H4  MOUNT-HOLE2.8  [2,8]
IC2  LM3671MF-1.8  [SOT23-5L]
IC3  AXP203H  [QFN48-6X6-H]
IC4  TPS562200DBV  [SOT23-6L]
J-PWR  POWER_JACKPTH_LOCK  [POWER_JACK_PTH_LOCK]
J-PWR2  CONN_02  [1X02]
JP3  PINHD-1X3  [1X03]
JP4  PINHD-1X2  [1X02]
JP5  PINHD-1X3  [1X03]
L1  2,2µH  L-EUR0805  [R0805]
L6  4.7u  L-EUL5650M  [L5650M]
L7  4.7u  L-EUL5650M  [L5650M]
L8  4.7u  L-EUL5650M  [L5650M]
L9  4.7u  L-EUL5650M  [L5650M]
L10  4.7u  L-EUL5650M  [L5650M]
LED1  LEDCHIPLED_0805  [CHIPLED_0805]
LED2  LEDCHIPLED_0805  [CHIPLED_0805]
PWR-ON  Power  SWITCH-MOMENTARY-2SMD  [TACTILE-SWITCH-SMD]
PWR-RESET  Power  SWITCH-MOMENTARY-2SMD  [TACTILE-SWITCH-SMD]
Q1  24Mhz  CRYSTALHC49U-V  [HC49U-V]
Q2  32kHz  CRYSTALTC38H  [TC38H]
R3  30m  R-EU_R2512  [R2512]
R4  11k  R-EU_R0603  [R0603]
R5  2k  R-EU_R0603  [R0603]
R6  200k  R-EU_R0603  [R0603]
R11  47k  R-EU_R0603  [R0603]
R12  240 - 1%  R-EU_R0603  [R0603]
R13  2k - 1%  R-EU_R0603  [R0603]
R14  2k - 1%  R-EU_R0603  [R0603]
R16  1k  R-EU_R0603  [R0603]
R17  1k  R-EU_R0603  [R0603]
R18  R-EU_R0603  [R0603]
R31  4.7k  R-EU_R0603  [R0603]
R33  4.7k  R-EU_R0603  [R0603]
R46  10k  R-EU_R0603  [R0603]
R47  R-EU_R0603  [R0603]
S-RST  SPARKFUN-SWITCHES_MOMENTARY-SWITCH-SPST-SMD-5.2-REDUNDANT  [SPARKFUN-SWITCHES_TACTILE_SWITCH_SMD_5.2MM]
U$6  XC6204  XC6204XC6204  [SOT25]
U$9  PT4101  [SOT23-6]

### Nets
!IRQ: IC3.48(!IRQ) R33.2
!RESET: C13.1 R11.1 R18.1 S-RST.3 S-RST.4 U$1.99(RESET)
!VBUSEN: IC3.6(!VBUSEN)
+1V2: C52.1 C53.1 C54.1 C55.1 C56.1 C62.1 C63.1 C64.1 C65.1 C66.1 C67.1 C86.1 IC3.10(FB2) L7.1 U$1.19(VDD-SYS3) U$1.20(VDD-CPU3) U$1.21(VDD-CPU2) U$1.25(VDD-CPU1) U$1.26(VDD-CPU0) U$1.38(VDD-CPU4) U$1.47(VDD-CPU5) U$1.51(VDD-CPU6) U$1.56(VDD-CPU7) U$1.58(VDD-SYS4) U$1.64(VDD-SYS5) U$1.80(VDD-SYS0) U$1.88(EPHY_VDD) U$1.108(VDD-SYS1) U$1.126(VDD-SYS2) ; also sheet 2
+1V8: C14.2 C38.2 C39.1 C47.1 C50.1 C51.1 C92.1 C93.1 IC2.4(FB) L10.1 R13.2 U$1.59(VCC-DRAM8) U$1.60(VCC-DRAM9) U$1.61(VCC-DRAM10) U$1.62(VCC-DRAM11) U$1.65(VCC-DRAM0) U$1.66(VCC-DRAM1) U$1.67(VCC-DRAM2) U$1.68(VCC-DRAM3) U$1.69(VCC-DRAM4) U$1.70(VCC-DRAM5) U$1.72(VCC-DRAM6) U$1.79(VCC-DRAM7) ; also sheet 2
+2V5: C76.1 JP3.1 U$6.5(VOUT)
+3V3: C31.1 C57.1 C58.1 C59.1 C60.1 C61.1 C69.1 C70.1 C85.1 IC3.13(LDVIN24) IC3.17(FB3) IC3.40(LDVIN3) JP3.3 JP5.1 L8.1 R11.2 U$1.50(VCC-3) U$1.57(VCC-2) U$1.85(VCC-MCSI) U$1.93(EPHY_VCC) U$1.104(VCC-0) U$1.109(VCC-USB) U$1.127(VCC-1) U$6.1(VIN) U$6.3(CE) ; supply symbol labelled VCC ; also sheet 1,2,3,5
+3V3A: C68.1 C71.1 C72.1 C91.1 IC3.12(LDO2) U$1.76(VCC-PLL) U$1.115(AVCC) ; also sheet 1,3
+5V: C73.1 D2.C IC3.31(VBUS) L1.1 R16.2 U$9.6(IN) ; also sheet 1,2,3
GND: C7.2 C8.2 C10.2 C11.1 C12.1 C13.2 C15.1 C31.2 C38.1 C39.2 C47.2 C50.2 C51.2 C52.2 C53.2 C54.2 C55.2 C56.2 C57.2 C58.2 C59.2 C60.2 C61.2 C62.2 C63.2 C64.2 C65.2 C66.2 C67.2 C68.2 C69.2 C70.2 C71.2 C72.2 C73.2 C74.2 C75.2 C76.2 C79.- C80.2 C81.- C82.2 C83.2 C84.2 C85.2 C86.2 C87.2 C88.2 C89.2 C90.2 C91.2 C92.2 C93.2 C94.2 IC2.2(GND) IC3.9(PGND) IC3.16(PGND) IC3.22(AGND) IC3.37(TEMP) IC3.46(PGND) IC3.P(PGND) IC4.1(GND) J-PWR2.1 J-PWR.GND J-PWR.GNDBREAK JP4.2 JP5.3 LED1.C LED2.C PWR-ON.1 R5.1 R6.1 R12.2 R14.1 R31.1 R46.2 R47.2 S-RST.1 S-RST.2 U$1.116(AGND) U$1.P$1(PAD) U$6.2(VSS) U$9.2(GND) ; also sheet 1,2,3,5
I2C1/SCL: IC3.2(SCL) ; also sheet 1,2,3
I2C1/SDA: IC3.1(SDA) ; also sheet 1,2,3
N$3: LED1.A R16.1
N$5: C79.+ C80.1 D2.A IC3.32(ADAPTER) IC3.33(ADAPTER) L6.1 R4.2
N$6: LED2.A R17.1
N$9: R46.1 U$9.4(EN)
N$10: D1.A L1.2 U$9.1(SW)
N$15: C78.1 IC4.2(VOUT) L6.2
N$16: C78.2 IC4.6(VBST)
N$17: IC4.4(FB) R4.1 R5.2
N$19: C81.+ D3.C IC4.3(VIN) IC4.5(CE)
N$23: C7.1 U$1.97(RTC-VIO)
N$24: IC3.23(BIAS) R6.2
N$25: C83.1 IC3.26(VINT) IC3.27(LDFB1)
N$26: JP5.2 U$1.98(VCC-RTC)
N$27: C84.1 IC3.24(VREF)
N$29: C10.1 Q2.2 U$1.95(X32KOUT)
N$30: C8.1 Q2.1 U$1.96(X32KIN)
N$31: IC3.8(LX2) L7.2
N$32: C11.2 Q1.1 U$1.74(X24MOUNT)
N$33: C12.2 Q1.2 U$1.75(X24MIN)
N$34: IC3.15(LX3) L8.2
N$36: R12.1 U$1.73(SZQ)
N$37: C87.1 IC3.43(CHSENSE) L9.2 R3.2
N$38: IC3.45(LX1) L9.1
N$39: C88.1 IC3.38(BATTERY) IC3.39(BATTERY) IC3.42(BATSENSE) JP4.1 R3.1
N$40: IC3.47(POWERON) PWR-ON.3
N$44: C89.1 IC3.41(LDO3)
N$45: C90.1 IC3.11(LDO4)
N$46: IC3.4(!OE) PWR-RESET.3 R31.2
N$50: IC3.25(PGOOD) R18.2
N$51: IC2.5(SW) L10.2
PB2: R17.2 ; also sheet 1
SVREF: C14.1 C15.2 R13.1 R14.2 U$1.63(SVREF1) U$1.71(SVREF0)
V_INPUT: D3.A J-PWR2.2 J-PWR.PWR
VBACKUP: IC3.28(LDO1)
VCC-PE: JP3.2 U$1.12(VCC-PE0) U$1.29(VCC-PE1) ; also sheet 1
VDD: C82.1 C94.1 IC2.1(VIN) IC2.3(CE) IC3.7(VIN2) IC3.14(VIN3) IC3.21(AVCC) IC3.29(CONFIG3) IC3.34(IPSOUT) IC3.35(IPSOUT) IC3.44(VIN1) PWR-RESET.1 R33.1 ; also sheet 3
VLED+: C74.1 C75.1 D1.C U$9.5(OV) ; also sheet 2
VLED-: R47.1 U$9.3(FB) ; also sheet 2
Unconnected: IC3.3(GPIO3) IC3.5(GPIO2) IC3.18(GPIO1) IC3.19(GPIO0/LDEN0) IC3.20(EXTEN) IC3.30(BACKUP) IC3.36(!CHARGE)

### Notes on the sheet
- Power CPU / SYS / USB / MIPI CSI / GPIO
- Power DRAM
- Power rails:
  
  VIN:   5-17V, 2A (barrel jack)
  VBUS:  5V, 1A (USB)
  VBAT:  4.2V (Li-po)
  VDD:   4.2V (Switched Li-po)
  VCC:   3.3V (System Voltage)
  AVDD:  3.0V (Analog, PLL)
  VDDR:  1.8V (DRAM)
  VCORE: 1.2V (ARM core + bus)
- LEDs
- Copyright (c) 2018 Marcel Thürmer <marcel.thuermer@smail.emt.h-brs.de>
  Open Source Hardware under the 3-clause BSD License
- Reset / Clock
- VCC / RTC / PLL

## Sheet 5 of 5: sn65lvds84
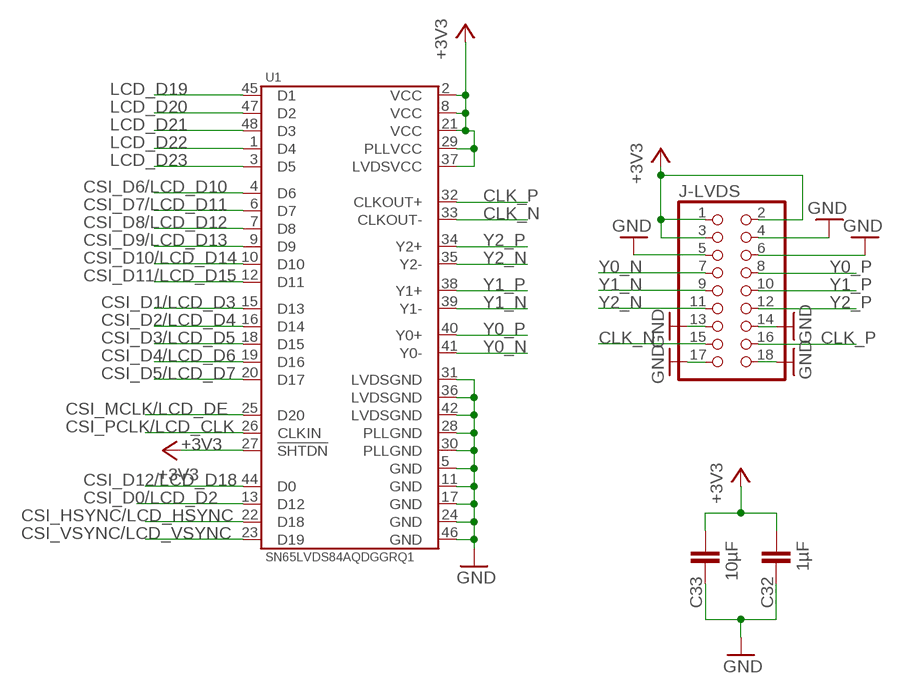
[diagram p5: schematic, sheet 5]

### Parts
C32  1µF  C-EUC0603  [C0603]
C33  10µF  C-EUC0805  [C0805]
J-LVDS  PINHEAD_PINHD-2X9M  [PINHEAD_2X09M]
U1  SN65LVDS84AQDGGRQ1  [TFSOP-48-6.1MM]

### Nets
+3V3: C32.1 C33.1 J-LVDS.1 J-LVDS.2 J-LVDS.3 U1.2(VCC) U1.8(VCC) U1.21(VCC) U1.27(!SHTDN) U1.29(PLLVCC) U1.37(LVDSVCC) ; also sheet 1,2,3,4
CLK_N: J-LVDS.15 U1.33(CLKOUT-)
CLK_P: J-LVDS.16 U1.32(CLKOUT+)
CSI_D0/LCD_D2: U1.13(D12) ; also sheet 1,2
CSI_D1/LCD_D3: U1.15(D13) ; also sheet 1,2
CSI_D2/LCD_D4: U1.16(D14) ; also sheet 1,2
CSI_D3/LCD_D5: U1.18(D15) ; also sheet 1,2
CSI_D4/LCD_D6: U1.19(D16) ; also sheet 1,2
CSI_D5/LCD_D7: U1.20(D17) ; also sheet 1,2
CSI_D6/LCD_D10: U1.4(D6) ; also sheet 1,2
CSI_D7/LCD_D11: U1.6(D7) ; also sheet 1,2
CSI_D8/LCD_D12: U1.7(D8) ; also sheet 1,2
CSI_D9/LCD_D13: U1.9(D9) ; also sheet 1,2
CSI_D10/LCD_D14: U1.10(D10) ; also sheet 1,2
CSI_D11/LCD_D15: U1.12(D11) ; also sheet 1,2
CSI_D12/LCD_D18: U1.44(D0) ; also sheet 1,2
CSI_HSYNC/LCD_HSYNC: U1.22(D18) ; also sheet 1,2
CSI_MCLK/LCD_DE: U1.25(D20) ; also sheet 1,2
CSI_PCLK/LCD_CLK: U1.26(CLKIN) ; also sheet 1,2
CSI_VSYNC/LCD_VSYNC: U1.23(D19) ; also sheet 1,2
GND: C32.2 C33.2 J-LVDS.4 J-LVDS.5 J-LVDS.6 J-LVDS.13 J-LVDS.14 J-LVDS.17 J-LVDS.18 U1.5(GND) U1.11(GND) U1.17(GND) U1.24(GND) U1.28(PLLGND) U1.30(PLLGND) U1.31(LVDSGND) U1.36(LVDSGND) U1.42(LVDSGND) U1.46(GND) ; also sheet 1,2,3,4
LCD_D19: U1.45(D1) ; also sheet 1,2
LCD_D20: U1.47(D2) ; also sheet 1,2
LCD_D21: U1.48(D3) ; also sheet 1,2
LCD_D22: U1.1(D4) ; also sheet 1,2
LCD_D23: U1.3(D5) ; also sheet 1,2
Y0_N: J-LVDS.7 U1.41(Y0-)
Y0_P: J-LVDS.8 U1.40(Y0+)
Y1_N: J-LVDS.9 U1.39(Y1-)
Y1_P: J-LVDS.10 U1.38(Y1+)
Y2_N: J-LVDS.11 U1.35(Y2-)
Y2_P: J-LVDS.12 U1.34(Y2+)

## Library data of the parts
ANT1 R1-R6 R8-R33 R36 R38-R47 R52 R53 = rcl:R-EU_: RESISTOR, European symbol
C1-C34 C38 C39 C47-C76 C78 C80 C82-C94 = rcl:C-EU: CAPACITOR, European symbol
C77 = resistor:C-EU: CAPACITOR, European symbol
C79 C81 = rcl:CPOL-EU: POLARIZED CAPACITOR, European symbol
D1 = diode:DIODE-: DIODE
D2 D3 = diode:SCHOTTKY-DIODE: Schottky Diode
H1 H2 H4 = holes:MOUNT-HOLE: MOUNTING HOLE with drill center marker
H3 = holes@1:MOUNT-HOLE: MOUNTING HOLE with drill center marker
IC2 = Allwinner V3s:LM3671?: Integrated Switch Synchronous Buck Converter
IC3 = Allwinner V3s:AXP203
IC4 = Allwinner V3s:TPS56*200
J3 = Connectors:USB
J4 = EAGLE-FPC_CONNECTOR_AND_FFC_CAB-rev16b:68611514122: WR-FPC 1.00mm SMT ZIF Horizontal Top Contact, 15 Pins=>Code : Con_FPC_ZIF_1.00_68611514122 <http://katalog.we-online.de/media/images/eican/Con_FPC_ZIF_1.00_6861xx14122_pf2.jpg> Details see: http://katalog.we-online.de/en/em/686_1xx_141_22 Created 2014-07-09, Karrer Zheng 2014 (C) Würth Elektronik
J-AUDIO = srg:JST-PH_4-PIN_HEADER: 4-pin JST PH Shrouded Header, top entry P/N B4B-PH-K-S Mating connector PHR-4 Mating cable assembly: Sparkfun PRT-09916 <http://www.sparkfun.com/products/9916>
J-CAM-FFC = con-molex:52745-2290: FFC/FPC-to-Board 0.50mm (.020") SMT Top Contact Right Angle, ZIF, Style Receptacle 52745 / 52435 Source: http://www.molex.com/product/ffc/52745.html; OC_FARNELL: unknown; OC_NEWARK: unknown
J-LCD-FFC = adafruit:40PINFPC: OMRON FPC Connector Source : http://www.omron.com/ecb/products/pdf/fpc.pdf XF2M-4015-rev is good for connecting up 'PSP' SHARP LQ043 LCDs
J-LVDS = Blueberry Pi:PINHEAD_PINHD-2X9: PIN HEADER
J-PWR = SparkFun-Connectors:POWER_JACK: Power Jack Connector This is the standard 5.5mm barrel jack for power. The PTH is the most common, proven, reliable, footprint. The Slot footprint only works if the mill layer is transmitted to the PCB fab house so be warned. Here are the connectors we sell at SparkFun: DC Barrel Power Jack/Connector <https://www.sparkfun.com/products/119> (PRT-00119) DC Barrel Power Jack/Connector (SMD) <https://www.sparkfun.com/products/12748> (PRT-12748) DC Barrel Jack Adapter - Breadboard Compatible <https://www.sparkfun.com/products/10811> (PRT-10811) It is used on this SparkFun product (and many, many others): SparkFun RedBoard - Programmed with Arduino <https://www.sparkfun.com/products/12757> (DEV-12757) Also, if you need a mating power supply or connector, please check these out: Wall Adapter Power Supply - 9VDC 650mA <https://www.sparkfun.com/products/298> (TOL-00298) DC Barrel Jack Adapter - Male <https://www.sparkfun.com/products/10287> (PRT-10287); PROD_ID: CONN-08197; SF_ID: PRT-00119
J-PWR2 = SparkFun-Connectors:CONN_02: Multi connection point. Often used as Generic Header-pin footprint for 0.1 inch spaced/style header connections On any of the 0.1 inch spaced packages, you can populate with these: Break Away Headers - Straight <https://www.sparkfun.com/products/116> (PRT-00116) Break Away Male Headers - Right Angle <https://www.sparkfun.com/products/553> (PRT-00553) Female Headers <https://www.sparkfun.com/products/115> (PRT-00115) Break Away Headers - Machine Pin <https://www.sparkfun.com/products/117> (PRT-00117) Break Away Female Headers - Swiss Machine Pin <https://www.sparkfun.com/products/743> (PRT-00743) For SCREWTERMINALS and SPRING TERMINALS visit here: Screw Terimnals on SparkFun.com <https://www.sparkfun.com/search/results?term=Screw+Terminals> (5mm/3.5mm/2.54mm spacing) This device is also useful as a general connection point to wire up your design to another part of your project. Our various solder wires solder well into these plated through hole pads. Hook-Up Wire - Assortment (Stranded, 22 AWG) <https://www.sparkfun.com/products/11375> (PRT-11375) Hook-Up Wire - Assortment (Solid Core, 22 AWG) <https://www.sparkfun.com/products/11367> (PRT-11367) View the entire wire category on our website here <https://www.sparkfun.com/categories/141> Special notes: Molex polarized connector foot print use with: PRT-08233 with associated crimp pins and housings. 2.54_SCREWTERM for use with PRT-10571. 3.5mm Screw Terminal footprints for PRT-08084 5mm Screw Terminal footprints for use with PRT-08432
J-VLED = con-molex:87758-0216: 2 Pin - 2mm Dual Row Single Wafer, Vertical T/H HDR Source: http://www.molex.com/pdm_docs/sd/877580616_sd.pdf; MPN: 87758-0216; OC_FARNELL: unknown; OC_NEWARK: 94M1513
JP1 = pinhead:PINHD-2X13: PIN HEADER
JP2 = pinhead-1:PINHD-1X6: PIN HEADER
JP3 JP5 JP7 = pinhead:PINHD-1X3: PIN HEADER
JP4 = pinhead:PINHD-1X2: PIN HEADER
JP10 = pinhead:PINHD-2X10: PIN HEADER
JP11 JP12 = pinhead:PINHD-2X8: PIN HEADER
L1 L2 L6-L10 = rcl:L-EU: INDUCTOR, European symbol
LED1 LED2 = led:LED: LED OSRAM: - CHIPLED LG R971, LG N971, LY N971, LG Q971, LY Q971, LO R971, LY R971 LH N974, LH R974 LS Q976, LO Q976, LY Q976 LO Q996 - Hyper CHIPLED LW Q18S LB Q993, LB Q99A, LB R99A - SideLED LS A670, LO A670, LY A670, LG A670, LP A670 LB A673, LV A673, LT A673, LW A673 LH A674 LY A675 LS A676, LA A676, LO A676, LY A676, LW A676 LS A679, LY A679, LG A679 - Hyper Micro SIDELED® LS Y876, LA Y876, LO Y876, LY Y876 LT Y87S - SmartLED LW L88C, LW L88S LB L89C, LB L89S, LG L890 LS L89K, LO L89K, LY L89K LS L896, LA L896, LO L896, LY L896 - TOPLED LS T670, LO T670, LY T670, LG T670, LP T670 LSG T670, LSP T670, LSY T670, LOP T670, LYG T670 LG T671, LOG T671, LSG T671 LB T673, LV T673, LT T673, LW T673 LH T674 LS T676, LA T676, LO T676, LY T676, LB T676, LH T676, LSB T676, LW T676 LB T67C, LV T67C, LT T67C, LS T67K, LO T67K, LY T67K, LW E67C LS E67B, LA E67B, LO E67B, LY E67B, LB E67C, LV E67C, LT E67C LW T67C LS T679, LY T679, LG T679 LS T770, LO T770, LY T770, LG T770, LP T770 LB T773, LV T773, LT T773, LW T773 LH T774 LS E675, LA E675, LY E675, LS T675 LS T776, LA T776, LO T776, LY T776, LB T776 LHGB T686 LT T68C, LB T68C - Hyper Mini TOPLED® LB M676 - Mini TOPLED Santana® LG M470 LS M47K, LO M47K, LY M47K Source: http://www.osram.convergy.de LUXEON: - LUMILED® LXK2-PW12-R00, LXK2-PW12-S00, LXK2-PW14-U00, LXK2-PW14-V00 LXK2-PM12-R00, LXK2-PM12-S00, LXK2-PM14-U00 LXK2-PE12-Q00, LXK2-PE12-R00, LXK2-PE12-S00, LXK2-PE14-T00, LXK2-PE14-U00 LXK2-PB12-K00, LXK2-PB12-L00, LXK2-PB12-M00, LXK2-PB14-N00, LXK2-PB14-P00, LXK2-PB14-Q00 LXK2-PR12-L00, LXK2-PR12-M00, LXK2-PR14-Q00, LXK2-PR14-R00 LXK2-PD12-Q00, LXK2-PD12-R00, LXK2-PD12-S00 LXK2-PH12-R00, LXK2-PH12-S00 LXK2-PL12-P00, LXK2-PL12-Q00, LXK2-PL12-R00 Source: www.luxeon.com KINGBRIGHT: KA-3528ASYC Source: www.kingbright.com
MIC = microphon:ELECTRET_MICROPHON-: Electret Condenser Microphone
PWR-ON PWR-RESET = SparkFun-Electromechanical:SWITCH-MOMENTARY-2: Various NO switches- pushbuttons, reed, etc; PROD_ID: SWCH-08247
Q1 = crystal:CRYSTAL: CRYSTAL; OC_FARNELL: 1666969; OC_NEWARK: unknown
Q2 = crystal:CRYSTAL: CRYSTAL; OC_FARNELL: unknown; OC_NEWARK: unknown
RN1 RN2 = resistor-dil:4R-N: Array Chip Resistor Source: RS Component / Phycomp; OC_FARNELL: unknown; OC_NEWARK: unknown
S-RST S-SEL S-START S-VOL+ S-VOL- = Blueberry Pi:SPARKFUN-SWITCHES_MOMENTARY-SWITCH-SPST: Momentary Switch (Pushbutton) - SPST Normally-open (NO) SPST momentary switches (buttons, pushbuttons). Variants PTH-12MM - 12mm square, through-hole Momentary Pushbutton Switch - 12mm Square <https://www.sparkfun.com/products/9190> (COM-09190) PTH-6.0MM, PTH-6.0MM-KIT - 6.0mm square, through-hole Mini Pushbutton Switch <https://www.sparkfun.com/products/97> (COM-00097) KIT package intended for soldering kit's - only one side of pads' copper is exposed. PTH-RIGHT-ANGLE-KIT - Right-angle, through-hole Right Angle Tactile Button <https://www.sparkfun.com/products/10791> - Used on SparkFun BigTime Watch Kit <https://www.sparkfun.com/products/11734> SMD-12MM - 12mm square, surface-mount Tactile Button - SMD (12mm) <https://www.sparkfun.com/products/12993> (COM-12993) Used on SparkFun PicoBoard <https://www.sparkfun.com/products/11888> SMD-4.5MM - 4.5mm Square Trackball Switch Used on SparkFun Blackberry Trackballer Breakout <https://www.sparkfun.com/products/13169> SMD-4.6MMX2.8MM - 4.60mm x 2.80mm, surface mount Used on SparkFun SAMD21 Mini Breakout <https://www.sparkfun.com/products/13664> SMD-5.2MM, SMD-5.2-REDUNDANT - 5.2mm square, surface-mount Mini Pushbutton Switch - SMD <https://www.sparkfun.com/products/8720> (COM-08720) Used on Arduino Pro Mini <https://www.sparkfun.com/products/11114> REDUNDANT package connects both switch circuits together SMD-6.0X3.5MM - 6.0 x 3.5mm, surface mount Momentary Reset Switch SMD <https://www.sparkfun.com/products/8229> (COM-08229) SMD-6.2MM-TALL - 6.2mm square, surface mount Tactile Button - SMD (6mm) <https://www.sparkfun.com/products/12992> Used on SparkFun Digital Sandbox <https://www.sparkfun.com/products/12651> SMD-RIGHT-ANGLE - Right-angle, surface mount Used on SparkFun Block for Intel® Edison - Arduino <https://www.sparkfun.com/products/13036>; PROD_ID: SWCH-08247; SF_SKU: COM-08720
U1 = TI:SN65LVDS84
U2 = SparkFun-IC-Memory:W25Q32FV: W25Q32FV 32Mb (4MB) Serial Flash Memory The W25Q32FV support the standard Serial Peripheral Interface (SPI), Dual/Quad I/O SPI as well as 2-clocks instruction cycle Quad Peripheral Interface (QPI). 104MHz, SPI, 8-SOIC-EIAJ Datasheet <http://www.winbond.com/resource-files/w25q32fv%20revh%20091613.pdf> SparkFun Products SparkFun Blynk Board - ESP8266 <https://www.sparkfun.com/products/13794> (WRL-13794); PROD_ID: IC-13229
U$1 = Allwinner V3s:V3S
U$2 = RTL8723BS_Modul:RTL8723BS
U$3 = HR911105A:HR911105A
U$5 = con-hirose:MICRO-USB-SHIELD-: Hirose Micro USB Connector ZX62R-B-5P: Micro B, reverse (top mount) shell SMT Supplier: DigiKey H11574CT-ND Source: http://www.hirose.co.jp/cataloge_hp/e24200011.pdf
U$6 = XC6204:XC6204
U$7 = tsc2003:TSC2003
U$8 = NS2009:NS2009
U$9 = PT4101:PT4101
U$11 = microsd:MICROSD-PUSH-OUT: T-Flash Push-Out Micro SD Card Reader 14.75mm x 14.5mm SMD with external pins
X2 = con-molex:87758-1216: 12 Pin - 2mm Dual Row Single Wafer, Vertical T/H HDR Source: http://www.molex.com/pdm_docs/sd/877580616_sd.pdf; MPN: 87758-1216; OC_FARNELL: unknown; OC_NEWARK: 25M5671